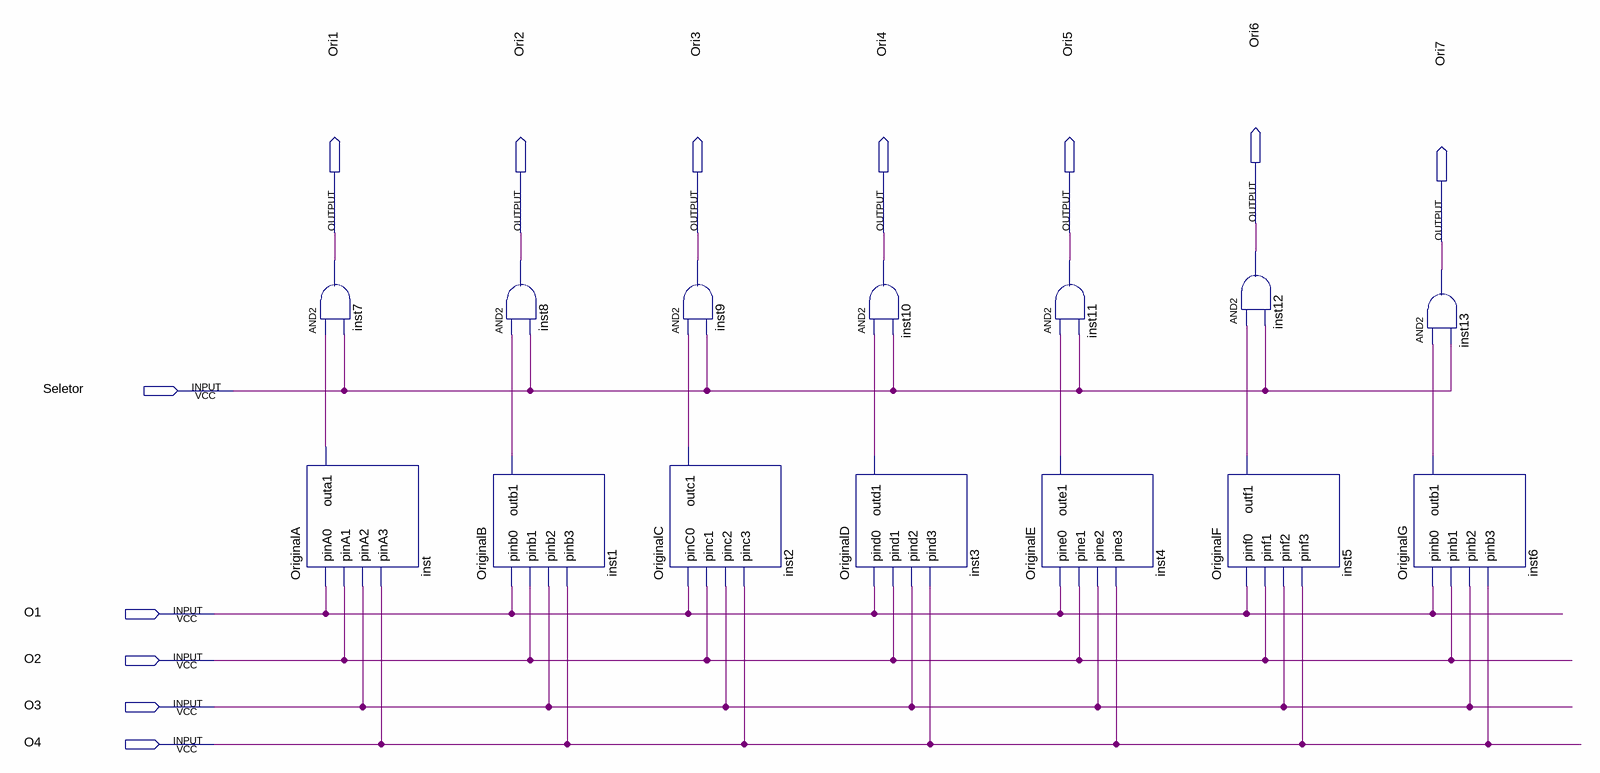
[diagram p0: schematic sheet]
// Quartus schematic MultiplexadorComplexo.bdf as structural Verilog: 14 symbols, 12 pins
module MultiplexadorComplexo (
  input  Seletor,
  input  O1,
  input  O2,
  input  O3,
  input  O4,
  output Ori6,
  output Ori1,
  output Ori2,
  output Ori3,
  output Ori4,
  output Ori5,
  output Ori7
);

  wire inst1_outb1, inst2_outc1, inst3_outd1, inst4_oute1, inst5_outf1, inst6_outb1, inst_outa1;

  OriginalA inst (.pinA0(O1), .pinA1(O2), .pinA2(O3), .pinA3(O4), .outa1(inst_outa1));
  and inst7 (Ori1, inst_outa1, Seletor);
  and inst8 (Ori2, inst1_outb1, Seletor);
  OriginalB inst1 (.pinb0(O1), .pinb1(O2), .pinb2(O3), .pinb3(O4), .outb1(inst1_outb1));
  OriginalC inst2 (.pinC0(O1), .pinc1(O2), .pinc2(O3), .pinc3(O4), .outc1(inst2_outc1));
  and inst9 (Ori3, inst2_outc1, Seletor);
  and inst10 (Ori4, inst3_outd1, Seletor);
  OriginalD inst3 (.pind0(O1), .pind1(O2), .pind2(O3), .pind3(O4), .outd1(inst3_outd1));
  OriginalE inst4 (.pine0(O1), .pine1(O2), .pine2(O3), .pine3(O4), .oute1(inst4_oute1));
  and inst11 (Ori5, inst4_oute1, Seletor);
  and inst12 (Ori6, inst5_outf1, Seletor);
  OriginalF inst5 (.pinf0(O1), .pinf1(O2), .pinf2(O3), .pinf3(O4), .outf1(inst5_outf1));
  OriginalG inst6 (.pinb0(O1), .pinb1(O2), .pinb2(O3), .pinb3(O4), .outb1(inst6_outb1));
  and inst13 (Ori7, inst6_outb1, Seletor);
endmodule
